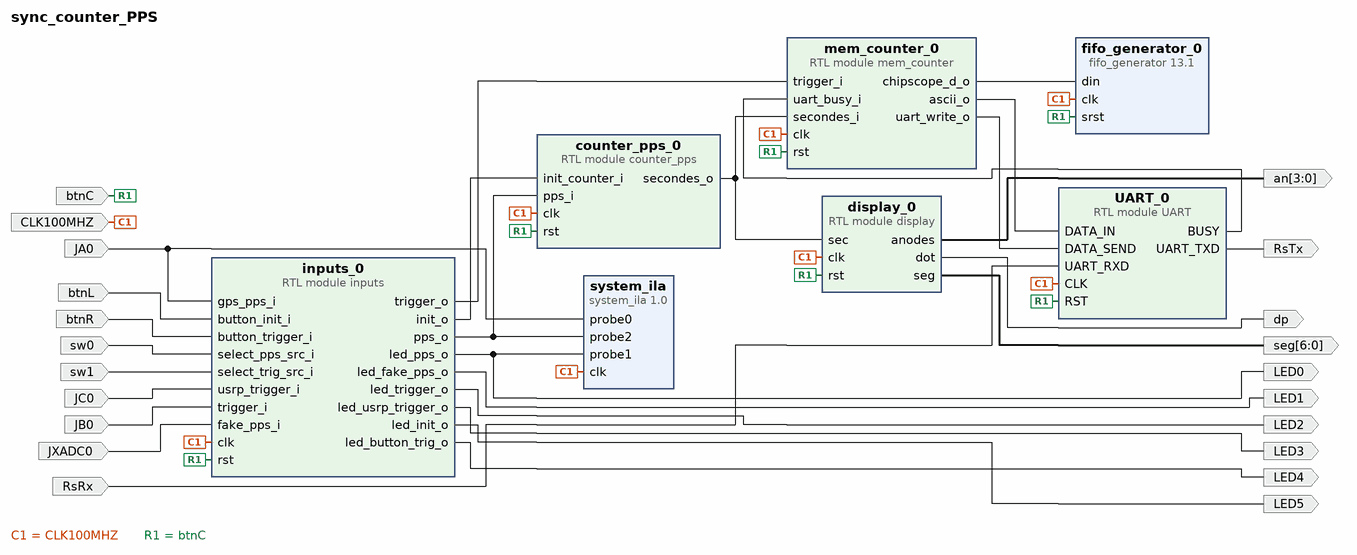
[diagram p0: block diagram of the top level]
# Vivado block design sync_counter_PPS, xc7a35tcpg236-1, Vivado 2016.4
create_bd_design sync_counter_PPS

create_bd_port -dir I -type clk CLK100MHZ
create_bd_port -dir I btnL
create_bd_port -dir O -from 3 -to 0 an
create_bd_port -dir O -from 6 -to 0 seg
create_bd_port -dir O dp
create_bd_port -dir I -type rst btnC
set_property -dict {CONFIG.POLARITY ACTIVE_HIGH} [get_bd_ports btnC]
create_bd_port -dir I RsRx
create_bd_port -dir O RsTx
create_bd_port -dir I btnR
create_bd_port -dir I sw0
create_bd_port -dir I sw1
create_bd_port -dir I JC0
create_bd_port -dir I JB0
create_bd_port -dir I JA0
create_bd_port -dir I JXADC0
create_bd_port -dir O LED0
create_bd_port -dir O LED1
create_bd_port -dir O LED2
create_bd_port -dir O LED3
create_bd_port -dir O LED5
create_bd_port -dir O LED4

create_bd_cell -type module -reference UART UART_0
set_property -dict {CONFIG.CLK_FREQ 100000000 CONFIG.PARITY_BIT none} [get_bd_cells UART_0]
create_bd_cell -type module -reference counter_pps counter_pps_0
create_bd_cell -type ip -vlnv xilinx.com:ip:fifo_generator:13.1 fifo_generator_0
set_property -dict {CONFIG.Input_Data_Width 64 CONFIG.Output_Data_Width 64} [get_bd_cells fifo_generator_0]
create_bd_cell -type module -reference mem_counter mem_counter_0
create_bd_cell -type module -reference inputs inputs_0
create_bd_cell -type ip -vlnv xilinx.com:ip:system_ila:1.0 system_ila
set_property -dict [list \
  CONFIG.C_PROBE2_TYPE 0 \
  CONFIG.C_PROBE1_TYPE 0 \
  CONFIG.C_PROBE0_TYPE 0 \
  CONFIG.C_NUM_OF_PROBES 3 \
  CONFIG.C_MON_TYPE NATIVE \
] [get_bd_cells system_ila]
create_bd_cell -type module -reference display display_0

# ---- connections ----

connect_bd_net -net clk_wiz_0_clk_out1 [get_bd_ports CLK100MHZ] \
  [get_bd_pins UART_0/CLK] [get_bd_pins counter_pps_0/clk] [get_bd_pins fifo_generator_0/clk] [get_bd_pins mem_counter_0/clk] \
  [get_bd_pins inputs_0/clk] [get_bd_pins system_ila/clk] [get_bd_pins display_0/clk]
connect_bd_net [get_bd_ports btnL] [get_bd_pins inputs_0/button_init_i]
connect_bd_net [get_bd_pins counter_pps_0/secondes_o] [get_bd_pins mem_counter_0/secondes_i] [get_bd_pins display_0/sec]
connect_bd_net [get_bd_pins display_0/anodes] [get_bd_ports an]
connect_bd_net [get_bd_pins display_0/seg] [get_bd_ports seg]
connect_bd_net [get_bd_pins display_0/dot] [get_bd_ports dp]
connect_bd_net -net proc_sys_reset_0_mb_reset [get_bd_ports btnC] \
  [get_bd_pins UART_0/RST] [get_bd_pins counter_pps_0/rst] [get_bd_pins fifo_generator_0/srst] \
  [get_bd_pins mem_counter_0/rst] [get_bd_pins inputs_0/rst] [get_bd_pins display_0/rst]
connect_bd_net -net fifo_generator_0_dout [get_bd_pins mem_counter_0/ascii_o] [get_bd_pins UART_0/DATA_IN]
connect_bd_net [get_bd_ports RsRx] [get_bd_pins UART_0/UART_RXD]
connect_bd_net [get_bd_pins UART_0/UART_TXD] [get_bd_ports RsTx]
connect_bd_net [get_bd_pins UART_0/BUSY] [get_bd_pins mem_counter_0/uart_busy_i]
connect_bd_net [get_bd_pins mem_counter_0/uart_write_o] [get_bd_pins UART_0/DATA_SEND]
connect_bd_net [get_bd_pins mem_counter_0/chipscope_d_o] [get_bd_pins fifo_generator_0/din]
connect_bd_net [get_bd_pins inputs_0/init_o] [get_bd_pins counter_pps_0/init_counter_i]
connect_bd_net [get_bd_ports btnR] [get_bd_pins inputs_0/button_trigger_i]
connect_bd_net -net sw0_1 [get_bd_ports sw0] [get_bd_pins inputs_0/select_pps_src_i]
connect_bd_net -net sw1_1 [get_bd_ports sw1] [get_bd_pins inputs_0/select_trig_src_i]
connect_bd_net -net JC0_1 [get_bd_ports JC0] [get_bd_pins inputs_0/usrp_trigger_i]
connect_bd_net -net JB0_1 [get_bd_ports JB0] [get_bd_pins inputs_0/trigger_i]
connect_bd_net -net JA0_1 [get_bd_ports JA0] [get_bd_pins inputs_0/gps_pps_i] [get_bd_pins system_ila/probe0]
connect_bd_net -net JXADC0_1 [get_bd_ports JXADC0] [get_bd_pins inputs_0/fake_pps_i]
connect_bd_net [get_bd_pins inputs_0/led_pps_o] [get_bd_ports LED0] [get_bd_pins system_ila/probe1]
connect_bd_net [get_bd_pins inputs_0/led_fake_pps_o] [get_bd_ports LED1]
connect_bd_net [get_bd_pins inputs_0/led_trigger_o] [get_bd_ports LED2]
connect_bd_net [get_bd_pins inputs_0/led_usrp_trigger_o] [get_bd_ports LED3]
connect_bd_net [get_bd_pins inputs_0/trigger_o] [get_bd_pins mem_counter_0/trigger_i]
connect_bd_net [get_bd_pins inputs_0/pps_o] [get_bd_pins counter_pps_0/pps_i] [get_bd_pins system_ila/probe2]
connect_bd_net [get_bd_pins inputs_0/led_init_o] [get_bd_ports LED5]
connect_bd_net [get_bd_pins inputs_0/led_button_trig_o] [get_bd_ports LED4]

validate_bd_design
save_bd_design
